# EasyEDA Pro project ESP32-NAT.epro

# Schematic Schematic1
Board Name: Board1; Create Date: 2025-11-01; Page Name: P1; Project Name: ESP32-NAT; Schematic Name: Schematic1; Update Date: 2025-12-23; Company: EasyEDA.com; Page Size: A4; Version: V1.0
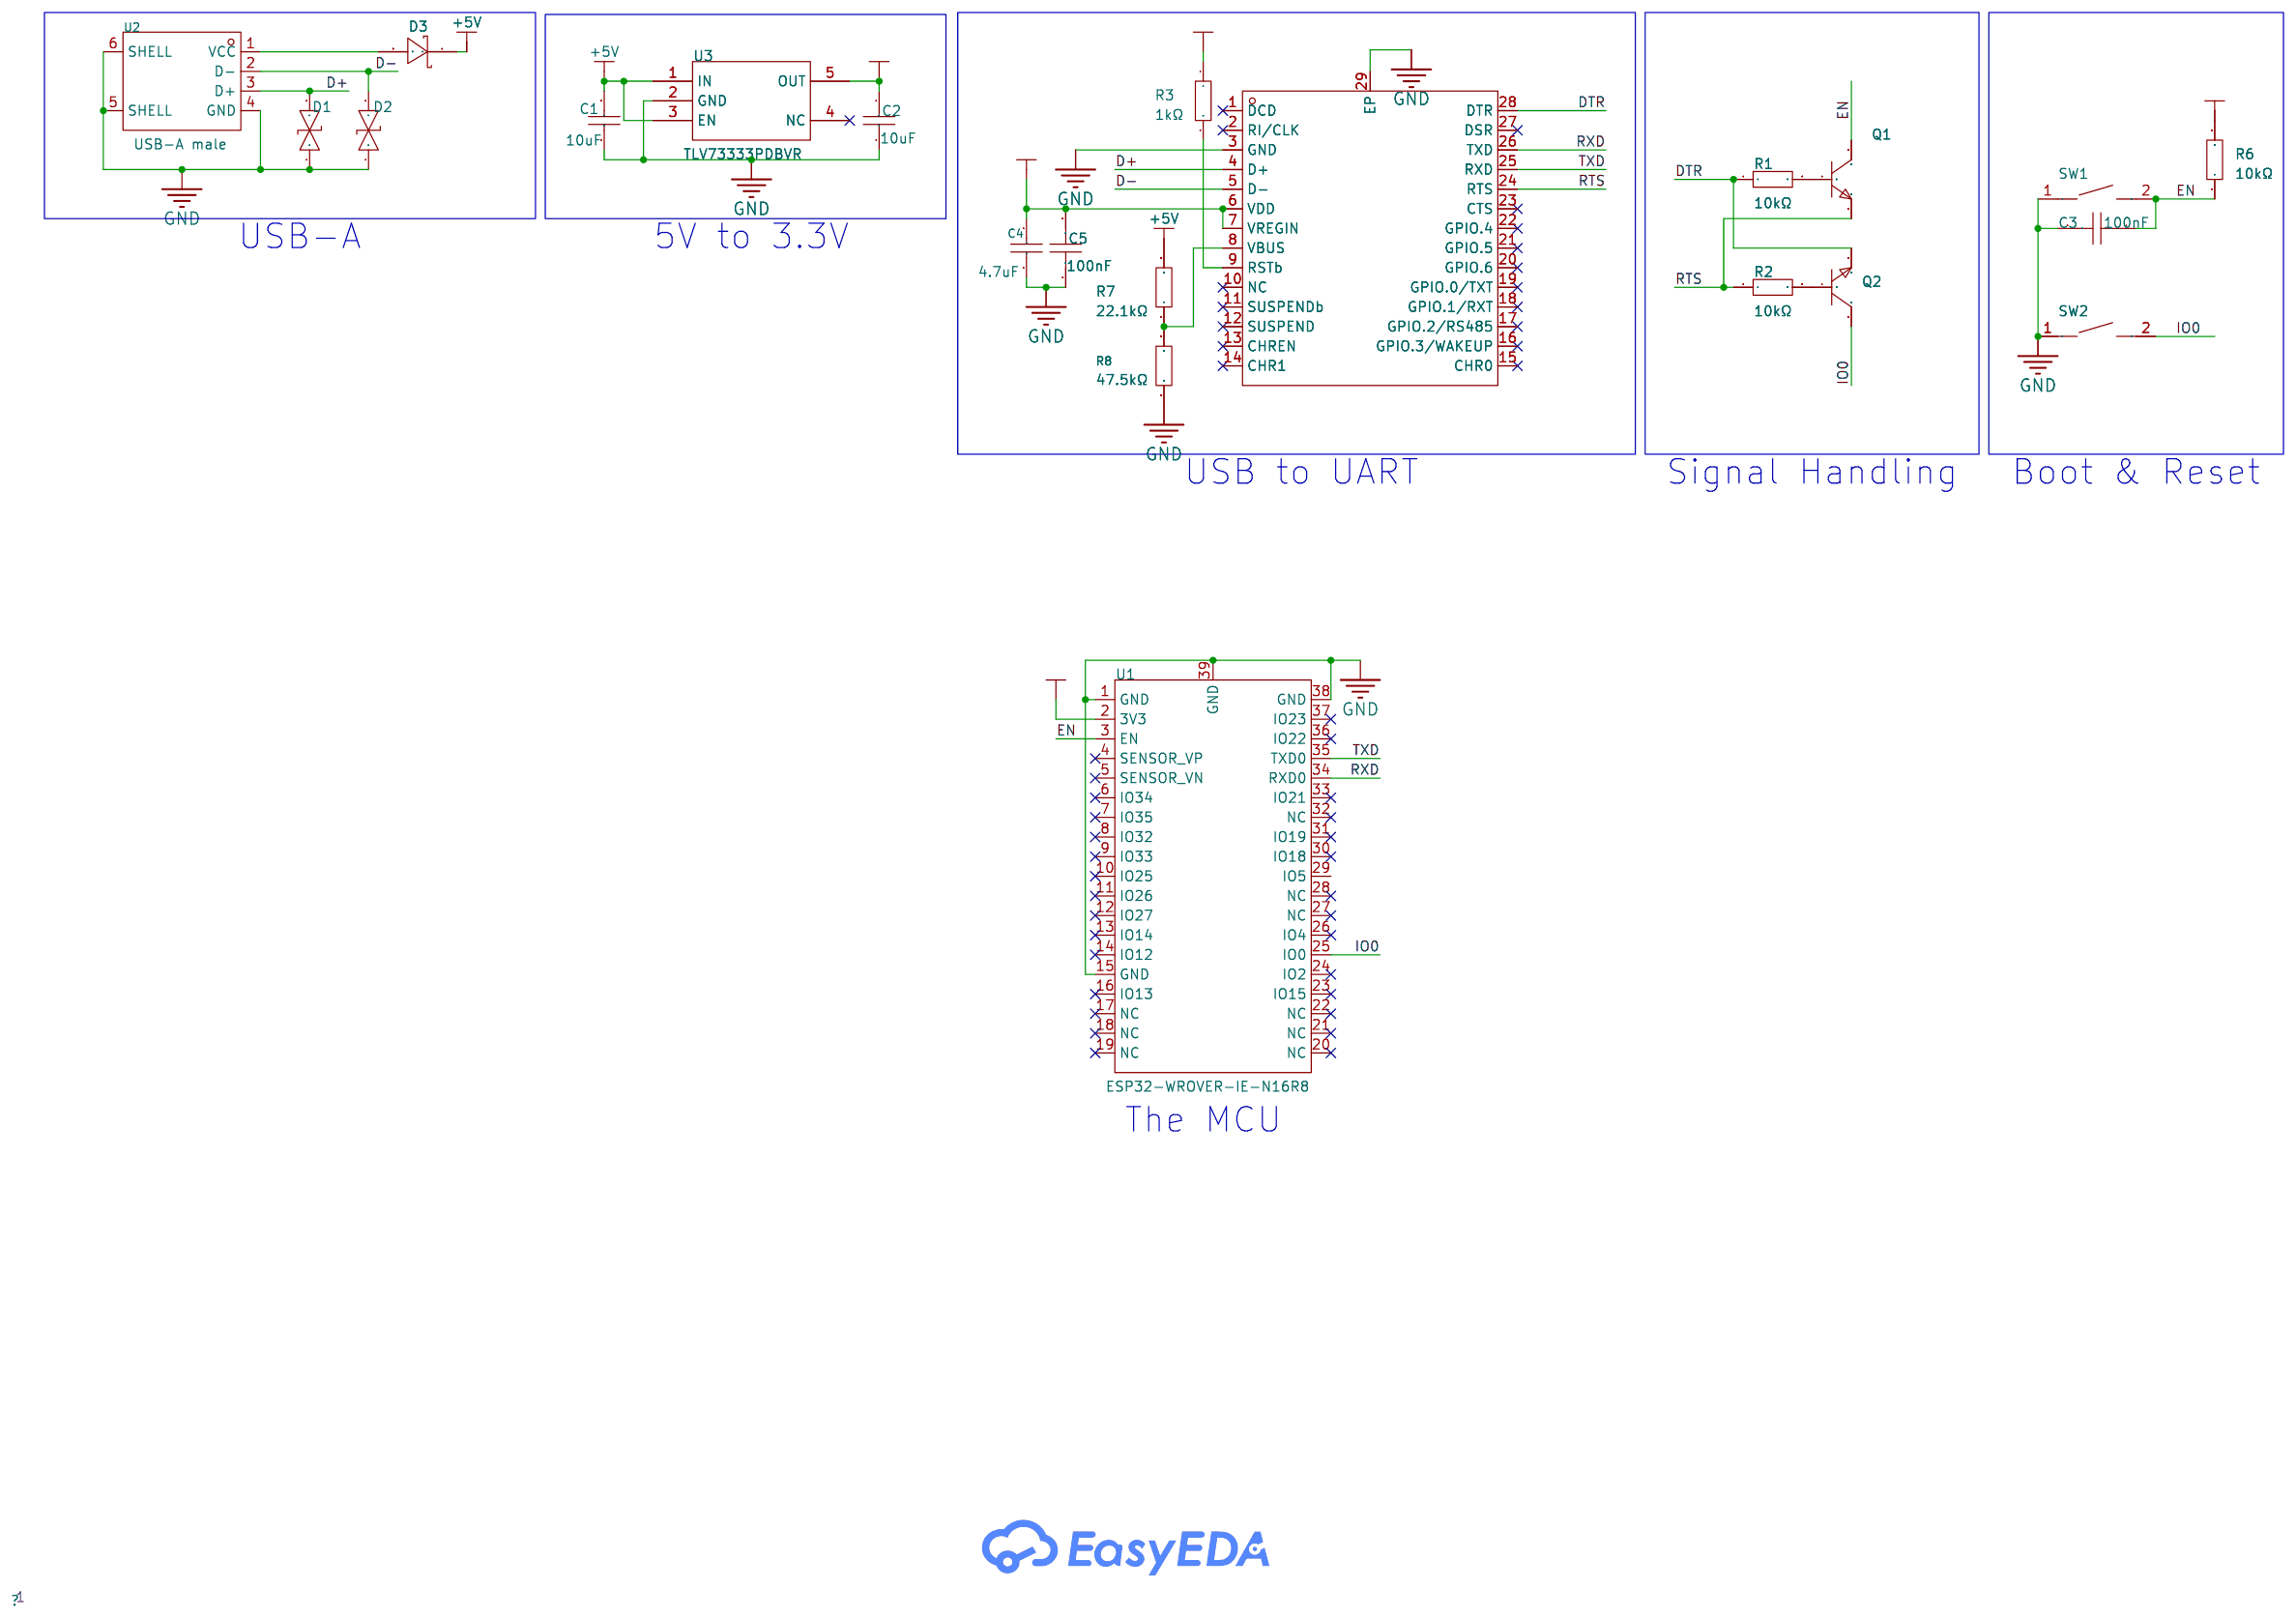
[diagram p0: schematic sheet]

## Parts
C1  10uF  [C0402_custom]
C2  10uF  [C0402_custom]
C3  100nF  [C0402_custom]
C4  4.7uF  [C0402_custom]
C5  100nF  [C0402_custom]
D1  LESD5D5.0CT1G-ES  [SOD-523_L1.2-W0.8-LS1.6-BI]
D2  LESD5D5.0CT1G-ES  [SOD-523_L1.2-W0.8-LS1.6-BI]
D3  BAT760-7  [SOD-323_L1.8-W1.3-LS2.5-RD]
Q1  SS8050-G  [SOT-23-3_L2.9-W1.5-P1.90-LS2.6-BR]
Q2  SS8050-G  [SOT-23-3_L2.9-W1.5-P1.90-LS2.6-BR]
R1  10kΩ  [R0402]
R2  10kΩ  [R0402]
R3  1kΩ  [R0402]
R6  10kΩ  [R0402]
R7  22.1kΩ  [R0402]
R8  47.5kΩ  [R0402]
SW1  TS-1088-AR02016  [SW-SMD_L3.9-W3.0-P4.45]
SW2  TS-1088-AR02016  [SW-SMD_L3.9-W3.0-P4.45]
U1  ESP32-WROVER-IE-N16R8  [WIFI-SMD_ESP32-WROVER-E-N8R2]
U2  USB-A male  [USB-SMD_USB-U203-BDS]
U3  TLV73333PDBVR  [SOT-23-5_L3.0-W1.7-P0.95-LS2.8-BR]
U4  CP2102N-A02-GQFN28R  [QFN-28_L5.0-W5.0-P0.50-TL-EP3.3]

## Library data of the parts
C1 C2 = CL05A106MQ5NUNC: Capacitance:10uF Tolerance:±20% Tolerance:±20% Voltage Rating:6.3V Temperature Coefficient:X5R; LCSC Part Name: 10uF ±20% 6.3V; Supplier Part: C15525; Manufacturer: SAMSUNG(三星); Supplier Footprint: 0402; Datasheet: https://item.szlcsc.com/datasheet/CL05A106MQ5NUNC/16204.html; Supplier: LCSC; Tolerance: ±20%; Voltage Rating: 6.3V; Temperature Coefficient: X5R
C3 C5 = CL05B104KO5NNNC: Capacitance:100nF Tolerance:±10% Tolerance:±10% Voltage Rating:16V Temperature Coefficient:X7R; LCSC Part Name: 100nF ±10% 16V; Supplier Part: C1525; Manufacturer: SAMSUNG(三星); Supplier Footprint: 0402; Datasheet: https://item.szlcsc.com/datasheet/CL05B104KO5NNNC/1877.html; Supplier: LCSC; Tolerance: ±10%; Voltage Rating: 16V; Temperature Coefficient: X7R
C4 = CL05A475MP5NRNC: Capacitance:4.7uF Tolerance:±20% Tolerance:±20% Voltage Rating:10V Temperature Coefficient:X5R; LCSC Part Name: 4.7uF ±20% 10V; Supplier Part: C23733; Manufacturer: SAMSUNG(三星); Supplier Footprint: 0402; Datasheet: https://item.szlcsc.com/datasheet/CL05A475MP5NRNC/24469.html; Supplier: LCSC; Tolerance: ±20%; Voltage Rating: 10V; Temperature Coefficient: X5R
D1 D2 = LESD5D5.0CT1G-ES: polarity:Bidirectional Reverse Stand-Off Voltage (Vrwm):5V Maximum Clamping Voltage:10V Peak Pulse Current (Ipp):8A Peak Pulse Power Dissipation (Ppp):80W Breakdown Voltage:5.8V Reverse Leakage Current (Ir):1uA Number of Lines:Single channel Operating Tem; LCSC Part Name: 普容5.0V，单路双向ESD静电防护器件，30kV，CJ：12pF；音频/视频/通讯防护; Supplier Part: C5199159; Manufacturer: ElecSuper(静芯微); Supplier Footprint: SOD523; Datasheet: https://atta.szlcsc.com/upload/public/pdf/source/20240905/10776531C4DE5F6ADA679023752259EC.pdf; Supplier: LCSC; polarity: Bidirectional; Reverse Stand-Off Voltage (Vrwm): 5V; Maximum Clamping Voltage: 10V; Peak Pulse Current (Ipp): 8A; Peak Pulse Power Dissipation (Ppp): 80W; Breakdown Voltage: 5.8V; Reverse Leakage Current (Ir): 1uA; Number of Lines: Single channel; Type: ESD
D3 = BAT760-7: Voltage - Forward(Vf@If):550mV@1A Voltage - DC Reverse(Vr):30V Current - Rectified:1A Reverse Leakage Current (Ir):50uA@15V Non-Repetitive Peak Forward Surge Current:5.5A; LCSC Part Name: 电压:30V 电流:1A; Supplier Part: C124187; Manufacturer: DIODES(美台); Supplier Footprint: SOD-323; Datasheet: https://item.szlcsc.com/datasheet/BAT760-7/125462.html; Supplier: LCSC; Voltage - Forward(Vf@If): 550mV@1A; Voltage - DC Reverse(Vr): 30V; Current - Rectified: 1A; Reverse Leakage Current (Ir): 50uA@15V; Non-Repetitive Peak Forward Surge Current: 5.5A
Q1 Q2 = SS8050-G: type:NPN Current - Collector(Ic):1.5A Collector - Emitter Voltage VCEO:25V Pd - Power Dissipation:300mW DC Current Gain:100@10mA,1V DC Current Gain:100@10mA,1V Transition frequency(fT):100MHz Current - Collector Cutoff:100nA Vce Saturation(VCE(sat)):400mV; LCSC Part Name: NPN 电流:1.5A 电压:25V; Supplier Part: C3199946; Manufacturer: Comchip(典琦); Supplier Footprint: SOT-23; Datasheet: https://item.szlcsc.com/datasheet/SS8050-G/3761708.html; Supplier: LCSC; type: NPN; Current - Collector(Ic): 1.5A; Collector - Emitter Voltage VCEO: 25V; Pd - Power Dissipation: 300mW; DC Current Gain: 100@10mA,1V; Transition frequency(fT): 100MHz; Current - Collector Cutoff: 100nA; Vce Saturation(VCE(sat)): 400mV@50mA,5mA
R1 R2 R6 = 0402WGF1002TCE: Type:Thick Film Resistor Resistance:10kΩ Tolerance:±1% Tolerance:±1% Power(Watts):62.5mW Voltage-Supply(Max):50V Temperature Coefficient:±100ppm/℃ Temperature Coefficient:±100ppm/℃ Operating Temperature:-55℃~+155℃ Operating Temperature:-55℃~+155℃; LCSC Part Name: 10kΩ ±1% 62.5mW 厚膜电阻; Supplier Part: C25744; Manufacturer: UNI-ROYAL(厚声); Supplier Footprint: 0402; JLCPCB Part Class: Basic Part; Datasheet: https://item.szlcsc.com/datasheet/0402WGF1002TCE/26487.html; Supplier: LCSC; Type: Thick Film Resistor; Tolerance: ±1%; Power(Watts): 62.5mW; Voltage-Supply(Max): 50V; Temperature Coefficient: ±100ppm/℃; Operating Temperature: -55℃~+155℃
R3 = 0402WGF1001TCE: Type:Thick Film Resistors Resistance:1kΩ Tolerance:±1% Tolerance:±1% Power(Watts): Overload Voltage (Max): Temperature Coefficient:±100ppm/℃ Temperature Coefficient:±100ppm/℃ Operating Temperature Range:-55℃~+155℃ Operating Temperature Range:-55℃~+155℃; LCSC Part Name: 1kΩ ±1% 62.5mW 厚膜电阻; Supplier Part: C11702; Manufacturer: UNI-ROYAL(厚声); Supplier Footprint: 0402; JLCPCB Part Class: Basic Part; Datasheet: https://atta.szlcsc.com/upload/public/pdf/source/20200306/C422600_1E6D84923E4A46A82E41ADD87F860B5C.pdf; Supplier: LCSC; Type: Thick Film Resistors; Tolerance: ±1%; Power(Watts): 62.5mW; Temperature Coefficient: ±100ppm/℃; Operating Temperature Range: -55℃~+155℃; Voltage-Supply(Max): 50V; Operating Temperature: -55℃~+155℃
R7 = 0402WGF2212TCE: Type:Thick Film Resistor Resistance:22.1kΩ Tolerance:±1% Tolerance:±1% Power(Watts):62.5mW Voltage-Supply(Max):50V Temperature Coefficient:±100ppm/℃ Temperature Coefficient:±100ppm/℃ Operating Temperature:-55℃~+155℃ Operating Temperature:-55℃~+155℃; LCSC Part Name: 22.1kΩ ±1% 62.5mW 厚膜电阻; Supplier Part: C43473; Manufacturer: UNI-ROYAL(厚声); Supplier Footprint: 0402; Datasheet: https://item.szlcsc.com/datasheet/0402WGF2212TCE/44464.html; Supplier: LCSC; Type: Thick Film Resistor; Tolerance: ±1%; Power(Watts): 62.5mW; Voltage-Supply(Max): 50V; Temperature Coefficient: ±100ppm/℃; Operating Temperature: -55℃~+155℃
R8 = 0402WGF4752TCE: Type:Thick Film Resistor Resistance:47.5kΩ Tolerance:±1% Tolerance:±1% Power(Watts):62.5mW Voltage-Supply(Max):50V Temperature Coefficient:±100ppm/℃ Temperature Coefficient:±100ppm/℃ Operating Temperature:-55℃~+155℃ Operating Temperature:-55℃~+155℃; LCSC Part Name: 47.5kΩ ±1% 62.5mW 厚膜电阻; Supplier Part: C25896; Manufacturer: UNI-ROYAL(厚声); Supplier Footprint: 0402; Datasheet: https://item.szlcsc.com/datasheet/0402WGF4752TCE/26639.html; Supplier: LCSC; Type: Thick Film Resistor; Tolerance: ±1%; Power(Watts): 62.5mW; Voltage-Supply(Max): 50V; Temperature Coefficient: ±100ppm/℃; Operating Temperature: -55℃~+155℃
SW1 SW2 = TS-1088-AR02016: Circuit:SPST Actuator Style:Round Button Operating Force:160gf Mounting Style:Brick nogging Switch Length:4mm Switch Width:3mm Switch Height:2mm Strike Gundam:不带 Contact Current:50mA Voltage Rating (DC):12V Insulation Resistance:100MΩ Actuator/Cap Color:B; LCSC Part Name: 4*3*2mm 立贴 轻触开关; Supplier Part: C720477; Manufacturer: XUNPU(讯普); Supplier Footprint: SMD; JLCPCB Part Class: Basic Part; Datasheet: https://atta.szlcsc.com/upload/public/pdf/source/20200810/C720475_60D09DD6C54279ADDB2DC25100F1CC11.pdf; Supplier: LCSC; Circuit: SPST; Actuator Style: Round Button; Operating Force: 160gf; Mounting Style: Brick nogging; Switch Length: 4mm; Switch Width: 3mm; Switch Height: 2mm; Strike Gundam: 不带; Contact Current: 50mA; Voltage Rating (DC): 12V; Insulation Resistance: 100MΩ; Actuator/Cap Color: Black; Pin Style: SMDSplicing; Mechanical Life: 10万次; Operating Temperature: -30℃~+80℃; Mounting Type: Surface Mount,Vertical; Length: 4mm; Width: 3mm; with Bracket: Without Bracket; Voltage Rating: 12V; Termination Style: SMD(SMT) Tab; Life: 100,000 Cycles
U1 = ESP32-WROVER-IE-N16R8: LCSC Part Name: 通用型Wi-Fi+BT+BLE MCU模组; Supplier Part: C701352; Manufacturer: ESPRESSIF(乐鑫); Supplier Footprint: SMD,18x31.4mm; JLCPCB Part Class: Extended Part; Datasheet: https://atta.szlcsc.com/upload/public/pdf/source/20200730/C701352_037A60005F1BF393F126A44EB320B018.pdf; Supplier: LCSC
U2 = USB-U203-BDS: Connector Type:Type-A Protocol Standard:USB 2.0 Gender:Male Mounting Type:Surface Mount, Right Angle Number of Contacts:4P Number of Ports:1 Current Rating-Power:1.5A Voltage Rating:30V Connect-Disconnect Life:1500 Cycles Operating Temperature:0℃~+50℃ Ope; LCSC Part Name: Type-A 公 卧贴; Supplier Part: C2962378; Manufacturer: HANBO(汉博); Supplier Footprint: SMD; JLCPCB Part Class: Extended Part; Datasheet: https://item.szlcsc.com/datasheet/USB-U203-BDS/3352870.html; Supplier: LCSC; Connector Type: Type-A; Protocol Standard: USB 2.0; Gender: Male; Mounting Type: Surface Mount, Right Angle; Number of Contacts: 4P; Number of Ports: 1; Current Rating-Power: 1.5A; Voltage Rating: 30V; Connect-Disconnect Life: 1500 Cycles; Operating Temperature: 0℃~+50℃
U3 = TLV73333PDBVR: Output Type:Fixed Voltage - Supply:5.5V Output Voltage:3.3V Output Voltage:3.3V Output Current:300mA Power Supply Rejection Ratio (PSRR):50dB@(1kHz) Voltage Dropout:125mV@(300mA) standby current:34uA Noise:28uVrms Features:Under Voltage Lockout；Over Curre; LCSC Part Name: 具有使能功能的 300mA、低 IQ、低压降无电容稳压器; Supplier Part: C134139; Manufacturer: TI(德州仪器); Supplier Footprint: SOT-23-5; JLCPCB Part Class: Extended Part; Datasheet: https://www.ti.com/cn/lit/gpn/tlv733p; Supplier: LCSC; Output Type: Fixed; Voltage - Supply: 5.5V; Output Voltage: 3.3V; Output Current: 300mA; Power Supply Rejection Ratio (PSRR): 50dB@(1kHz); Voltage Dropout: 125mV@(300mA); standby current: 34uA; Noise: 28uVrms; Features: Under Voltage Lockout；Over Current Protection；Enable；Over Temperature Protection; Operating Temperature: -40℃~+125℃@(Tj); Output Configuration: Positive; Number of Outputs: 1
U4 = CP2102N-A02-GQFN28R: Applications Function:USB to UART USB Protocol:USB 2.0 Voltage - Supply:3V~3.6V Voltage - Supply:3V~3.6V Operating Temperature:-40℃~+85℃@(Ta) Operating Temperature:-40℃~+85℃@(Ta) Current - Supply:9.5mA Supply Current (Iq):1.3uA; Supplier Part: C964632; Manufacturer: SKYWORKS/SILICON LABS(芯科); Supplier Footprint: QFN-28-EP(5x5); JLCPCB Part Class: Extended Part; Datasheet: https://item.szlcsc.com/datasheet/CP2102N-A02-GQFN28R/1049893.html; Supplier: LCSC; Applications Function: USB to UART; USB Protocol: USB 2.0; Voltage - Supply: 3V~3.6V; Operating Temperature: -40℃~+85℃@(Ta); Current - Supply: 9.5mA; Supply Current (Iq): 1.3uA

## Nets
+3V3: C2.2 C4.2 C5.2 R3.1 R6.2 U1.2(3V3) U3.5(OUT) U4.6(VDD) U4.7(VREGIN)
+5V: C1.2 D3.1 R7.2 U3.1(IN) U3.3(EN)
GND: C1.1 C2.1 C3.2 C4.1 C5.1 D1.1 D2.1 R8.1 SW1.1 SW2.1 U1.1(GND) U1.15(GND) U1.38(GND) U1.39(GND) U2.4(GND) U2.5(SHELL) U2.6(SHELL) U3.2(GND) U4.3(GND) U4.29(EP)
D+: D1.2 U2.3(D+) U4.4(D+)
D-: D2.2 U2.2(D-) U4.5(D-)
DTR: Q2.2(E) R1.1 U4.28(DTR)
EN: C3.1 Q1.3(C) R6.1 SW1.2 U1.3(EN)
IO0: Q2.3(C) SW2.2 U1.25(IO0)
RTS: Q1.2(E) R2.1 U4.24(RTS)
RXD: U1.34(RXD0) U4.26(TXD)
TXD: U1.35(TXD0) U4.25(RXD)
$1N11244: D3.2 U2.1(VCC)
$1N12278: Q1.1(B) R1.2
$1N12283: Q2.1(B) R2.2
$1N13367: R3.2 U4.9(RSTb)
$1N15037: R7.1 R8.2 U4.8(VBUS)

Not connected (* = marked no-connect by the designer): U1 4(SENSOR_VP)* 5(SENSOR_VN)* 6(IO34)* 7(IO35)* 8(IO32)* 9(IO33)* 10(IO25)* 11(IO26)* 12(IO27)* 13(IO14)* 14(IO12)* 16(IO13)* 17(NC)* 18(NC)* 19(NC)* 20(NC)* 21(NC)* 22(NC)* 23(IO15)* 24(IO2)* 26(IO4)* 27(NC)* 28(NC)* 29(IO5) 30(IO18)* 31(IO19)* 32(NC)* 33(IO21)* 36(IO22)* 37(IO23)*; U3 4(NC)*; U4 1(DCD)* 2(RI/CLK)* 10(NC)* 11(SUSPENDb)* 12(SUSPEND)* 13(CHREN)* 14(CHR1)* 15(CHR0)* 16(GPIO.3/WAKEUP)* 17(GPIO.2/RS485)* 18(GPIO.1/RXT)* 19(GPIO.0/TXT)* 20(GPIO.6)* 21(GPIO.5)* 22(GPIO.4)* 23(CTS)* 27(DSR)*

## Notes on the sheet
- USB-A
- 5V to 3.3V
- USB to UART
- Signal Handling
- Boot & Reset
- The MCU

# Board PCB1
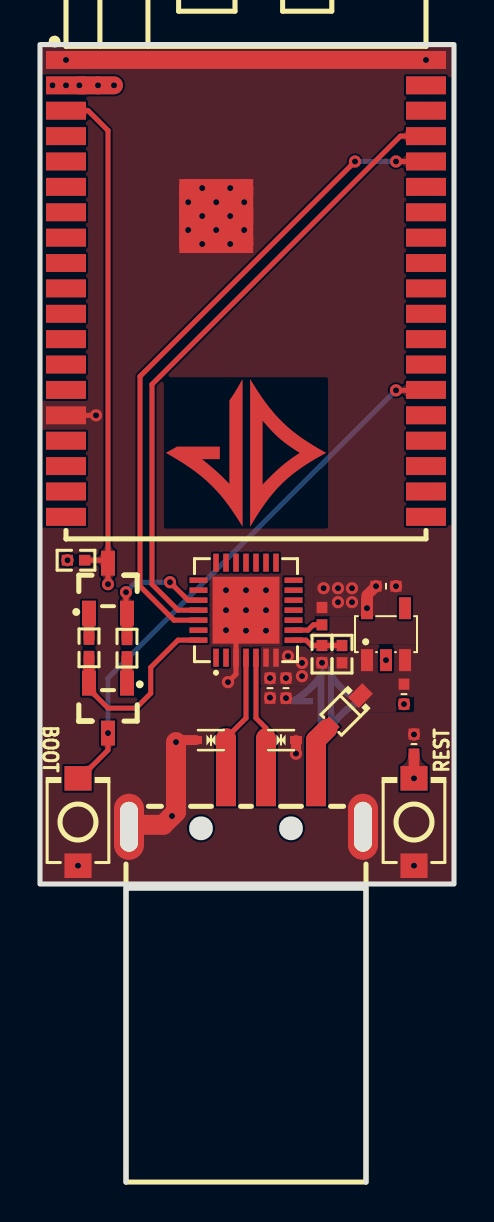
[diagram p1: board, top side]
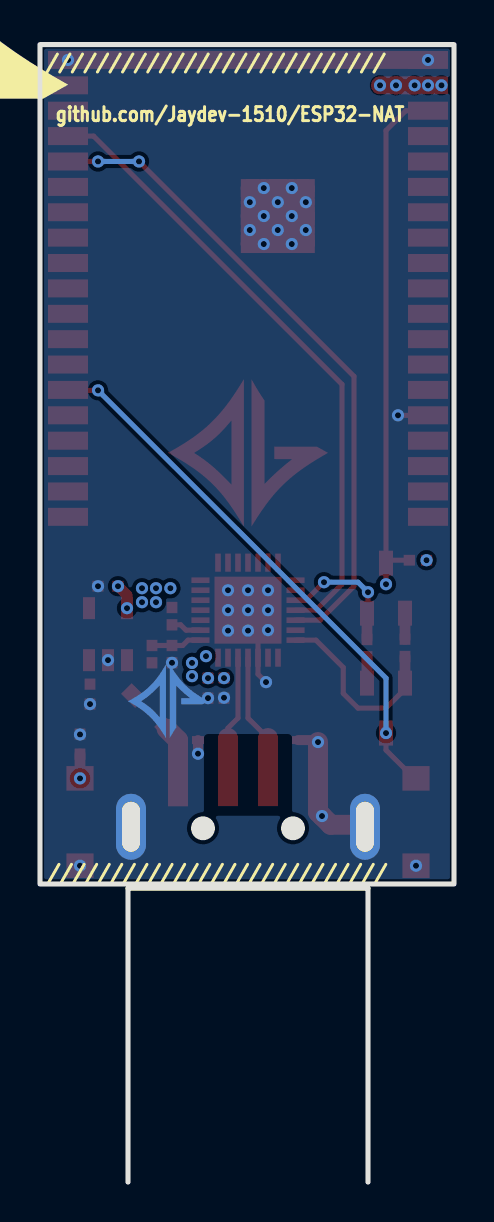
[diagram p2: board, bottom side, seen from below]

Outline 20.7 x 56.91 mm; copper layers: Top Layer, Inner1, Inner2, Bottom Layer. Coordinates in mm from the lower left corner of the outline.
Outline path: rectangle 0,56.91 20.7,14.91
Stack: Top Layer 0.035mm Outer layer thickness 1oz / Dielectric1 0.2104mm 7628 RC49% 8.6mil / Inner1 0.0152mm Inner layer thickness / Dielectric2 1.065mm 1.1mm H/HOZ Copper / Inner2 0.0152mm Inner layer thickness / Dielectric3 0.2104mm 7628 RC49% 8.6mil / Bottom Layer 0.035mm Outer layer thickness 1oz

## Design rules (mm)
template: Custom Config
spacing copperThickness1oz (default): track to track 0.102, other pairs 0.152 to 0.3
spacing copperThickness2oz: track to track 0.203, other pairs 0.152 to 0.3
track width copperThickness1oz (default): min 0.127, default 0.254, max 2.54
track width copperThickness2oz: min 0.203, default 0.254, max 2.54
differential pair differentialPair (default): width min 0.127, default 0.254, max 2.54; gap min 0.152, default 0.152
via viaSize (default): diameter min 0.5, default 0.61, max 10; hole min 0.3, default 0.305, max 6.3

## Placement (name value [footprint] x y rotation side)
C1  10uF  [C0402_custom]  18.2 24.41 90 top
C2  10uF  [C0402_custom]  17.3 29.81 180 top
C3  100nF  [C0402_custom]  18.7 21.91 90 top
C4  4.7uF  [C0402_custom]  12.3 24.71 90 top
C5  100nF  [C0402_custom]  11.5 24.71 90 top
D1  LESD5D5.0CT1G-ES  [SOD-523_L1.2-W0.8-LS1.6-BI]  8.55 22.11 0 top
D2  LESD5D5.0CT1G-ES  [SOD-523_L1.2-W0.8-LS1.6-BI]  12.05 22.11 180 top
D3  BAT760-7  [SOD-323_L1.8-W1.3-LS2.5-RD]  15.2 23.51 225 top
Q1  SS8050-G  [SOT-23-3_L2.9-W1.5-P1.90-LS2.6-BR]  3.4 29.71 270 top
Q2  SS8050-G  [SOT-23-3_L2.9-W1.5-P1.90-LS2.6-BR]  3.4 23.71 90 top
R1  10kΩ  [R0402]  2.45 26.73 90 top
R2  10kΩ  [R0402]  4.35 26.71 270 top
R3  1kΩ  [R0402]  14.1 28.31 270 top
R6  10kΩ  [R0402]  1.8 31.11 180 top
R7  22.1kΩ  [R0402]  15.1 26.41 270 top
R8  47.5kΩ  [R0402]  14.1 26.41 90 top
SW1  TS-1088-AR02016  [SW-SMD_L3.9-W3.0-P4.45]  18.7 18.01 90 top
SW2  TS-1088-AR02016  [SW-SMD_L3.9-W3.0-P4.45]  1.9 18.01 90 top
U1  ESP32-WROVER-IE-N16R8  [WIFI-SMD_ESP32-WROVER-E-N8R2]  10.3 44.71 0 top
U2  USB-A male  [USB-SMD_USB-U203-BDS]  10.3 18.91 0 top
U3  TLV73333PDBVR  [SOT-23-5_L3.0-W1.7-P0.95-LS2.8-BR]  17.3 27.41 270 top
U4  CP2102N-A02-GQFN28R  [QFN-28_L5.0-W5.0-P0.50-TL-EP3.3]  10.3 28.61 90 top

## Footprints (pads in the part's own frame, mm; a bottom-side part is the same pattern mirrored in y, then rotated)
C0402_custom
  rect 0.56x0.54 smd: 1(-0.5,0) 2(0.5,0)
QFN-28_L5.0-W5.0-P0.50-TL-EP3.3
  rect 0.905x0.28 smd: 1(-2.377,1.5) 2(-2.377,1) 3(-2.377,0.5) 4(-2.377,0) 5(-2.377,-0.5) 6(-2.377,-1) 7(-2.377,-1.5) 15(2.377,-1.5) 16(2.377,-1) 17(2.377,-0.5) 18(2.377,0) 19(2.377,0.5) 20(2.377,1) 21(2.377,1.5)
  rect 0.28x0.905 smd: 8(-1.5,-2.377) 9(-1,-2.377) 10(-0.5,-2.377) 11(0,-2.377) 12(0.5,-2.377) 13(1,-2.377) 14(1.5,-2.377) 22(1.5,2.377) 23(1,2.377) 24(0.5,2.377) 25(0,2.377) 26(-0.5,2.377) 27(-1,2.377) 28(-1.5,2.377)
  rect 3.35x3.35 smd: 29(0,0)
R0402
  rect 0.566x0.54 smd: 1(-0.433,0) 2(0.433,0)
SOD-323_L1.8-W1.3-LS2.5-RD
  rect 1x0.75 smd: 1(-1.173,0) 2(1.173,0)
SOD-523_L1.2-W0.8-LS1.6-BI
  rect 0.6x0.4 smd: 1(-0.75,0) 2(0.75,0)
SOT-23-3_L2.9-W1.5-P1.90-LS2.6-BR
  rect 1.25x0.7 smd: 1(1.25,-0.95) 2(1.25,0.95) 3(-1.25,0)
SOT-23-5_L3.0-W1.7-P0.95-LS2.8-BR
  rect 1.1x0.6 smd: 1(1.3,-0.95) 2(1.3,0) 3(1.3,0.95) 4(-1.3,0.95) 5(-1.3,-0.95)
SW-SMD_L3.9-W3.0-P4.45
  rect 1.23x1.36 smd: 1(-2.185,0) 2(2.185,0)
USB-SMD_USB-U203-BDS
  rect 1x2.5 smd: 1(3.5,1.137) 2(1,1.137) 3(-1,1.137) 4(-3.5,1.137)
  oval 1.5x3.3 hole 0.9x2.5: 5(-5.85,-1.137) 6(5.85,-1.137)
WIFI-SMD_ESP32-WROVER-E-N8R2
  rect 2x0.9 smd: 1(-9,11.43) 2(-9,10.16) 3(-9,8.89) 4(-9,7.62) 5(-9,6.35) 6(-9,5.08) 7(-9,3.81) 8(-9,2.54) 9(-9,1.27) 10(-9,0) 11(-9,-1.27) 12(-9,-2.54) 13(-9,-3.81) 14(-9,-5.08) 15(-9,-6.35) 16(-9,-7.62) 17(-9,-8.89) 18(-9,-10.16) 19(-9,-11.43) 20(9,-11.43) 21(9,-10.16) 22(9,-8.89) 23(9,-7.62) 24(9,-6.35) 25(9,-5.08) 26(9,-3.81) 27(9,-2.54) 28(9,-1.27) 29(9,0) 30(9,1.27) 31(9,2.54) 32(9,3.81) 33(9,5.08) 34(9,6.35) 35(9,7.62) 36(9,8.89) 37(9,10.16) 38(9,11.43)
  rect 0.9x0.9 smd: 39(-2.89,5.02) 39(-2.89,3.62) 39(-2.89,2.22) 39(-1.49,5.02) 39(-1.49,3.62) 39(-1.49,2.22) 39(-0.09,5.02) 39(-0.09,3.62) 39(-0.09,2.22)

## Nets
As in the schematic.

Pads without a net: U1 4 5 6 7 8 9 10 11 12 13 14 16 17 18 19 20 21 22 23 24 26 27 28 29 30 31 32 33 36 37; U3 4; U4 1 2 10 11 12 13 14 15 16 17 18 19 20 21 22 23 27

## Via types
v1: diameter 0.61, hole 0.305, Top Layer to Bottom Layer, 63 vias

## Routing (per net, layer and track width the routed paths; a pad name or vN(x,y) marks a point on that pad's centre or on a via; arc(x,y) is an arc through that point)
+3V3: length 3.7
  Top Layer w0.254: v1(1.3,54.87) v1(1.97,54.87)
  Top Layer w0.54: v1(16.8,29.81) 16.35,29.36 v1(16.35,28.71)
  Top Layer w0.9: v1(1.97,54.87) v1(2.9,54.87) v1(3.7,54.87)
  vias: v1(0.63,54.87) v1(1.37,31.11) v1(11.5,25.21) v1(12.3,25.21) v1(12.4,26.31) v1(13.1,25.97) v1(13.1,25.31) v1(14.18,29.71) v1(14.9,29.71) v1(14.9,29.01) v1(15.6,29.71) v1(15.6,29.01)
GND: length 56
  Top Layer w0.254: U1.15 v1(2.8,38.36) ; v1(9.4,25.01) 9.8,25.41 U4.3 9.8,28.11 v1(10.3,28.61)
  Top Layer w0.5: D2.1 v1(12.8,21.43) ; D1.1 6.9,22.11 v1(6.8,22.01)
  Top Layer w0.9: U1.39 v1(10.21,49.03) U1.39 ; U1.39 v1(10.21,47.63) U1.39 ; U1.39 v1(9.51,48.33) U1.39 ; U1.39 U1.39 ; U1.39 v1(9.51,49.73) U1.39 ; U1.39 v1(9.51,46.93) U1.39 ; U1.39 U1.39 ; U1.39 v1(7.41,49.03) U1.39 ; U1.39 v1(8.11,48.33) U1.39 ; U1.39 v1(7.41,47.63) U1.39 ; U1.39 v1(8.81,47.63) U1.39 ; U1.39 v1(8.81,49.03) U1.39 ; U1.39 U1.39 ; U1.39 U1.39 ; U1.39 v1(8.11,46.93) U1.39 ; U1.39 v1(8.11,49.73) U1.39 ; v1(19.3,56.14) v1(1.3,56.14)
  Top Layer w1: 4.45,17.88 6.16,17.88 v1(6.6,18.31) 6.8,18.51 U2.4 v1(6.8,22.01)
  vias: v1(1.9,15.83) v1(9.3,29.61) v1(9.3,28.61) v1(9.3,27.61) v1(10.3,29.61) v1(10.3,27.59) v1(11.3,29.61) v1(11.3,28.61) v1(11.3,27.59) v1(11.5,24.23) v1(12.3,24.21) v1(14.1,25.98) v1(17.3,26.11) v1(17.8,29.81) v1(18.2,23.91) v1(18.7,22.39) v1(18.7,15.83)
D+: length 6.5
  Top Layer w0.254: 9.3,22.21 10.3,23.21 U4.4
  Top Layer w1: 9.3,22.21 9.3,20.15
D-: length 6.3
  Top Layer w0.254: 11.3,22.21 11.3,22.71 10.8,23.21 U4.5
  Top Layer w1: 11.3,20.15 11.3,22.21
DTR: length 9.7
  Top Layer w0.254: U4.28 6.9,27.11 5.54,25.75 5.54,24.45 4.8,23.71 3.4,23.71 2.45,24.66 Q2.2
  Top Layer w0.54: R1.1 Q2.2
EN: length 47.6
  Top Layer w0.254: Q1.3 3.25,31.11 R6.1 ; Q1.3 v1(3.4,29.91) ; Q1.3 3.4,52.61 2.41,53.6 U1.3
  Top Layer w0.54: C3.1 v1(18.7,20.2)
  Inner1 w0.254: v1(3.4,29.91) 3.4,28.81 9,23.21 15.69,23.21 v1(18.7,20.2)
IO0: length 27.6
  Top Layer w0.254: 1.9,20.2 1.98,20.2 3.4,21.61 v1(3.4,22.46) ; U1.25 19.28,39.61 v1(17.8,39.61)
  Bottom Layer w0.254: v1(3.4,22.46) 3.4,25.21 v1(17.8,39.61)
RTS: length 6.6
  Top Layer w0.254: U4.24 7.4,29.11 v1(6.5,30.01) ; v1(4.3,29.51) 4.3,28.51 Q1.2
  Top Layer w0.54: Q1.2 R2.1
  Bottom Layer w0.254: v1(6.5,30.01) 4.8,30.01 v1(4.3,29.51)
RXD: length 32.9
  Top Layer w0.254: v1(17.8,51.06) U1.34 ; v1(15.75,51.06) 5,40.31 5,29.81 6.7,28.11 U4.26
  Bottom Layer w0.254: v1(15.75,51.06) v1(17.8,51.06)
TXD: length 31.7
  Top Layer w0.254: U4.25 6.9,28.61 5.6,29.91 5.6,39.91 18.02,52.33 U1.35
$1N11244: length 2.9
  Top Layer w1: 14.37,22.68 13.8,22.11 U2.1
$1N12278: length 1.3
  Top Layer w0.54: Q1.1 R1.2
$1N12283: length 1.3
  Top Layer w0.543: 4.35,26.28 Q2.1
$1N13367: length 1.5
  Top Layer w0.254: U4.9 13.4,27.61 13.67,27.88 R3.2
$1N15037: length 2.5
  Top Layer w0.254: R7.1 R8.2 13.57,26.84 13.3,27.11 U4.8

## Copper pours and planes (outline as drawn; the poured copper is in the pictures)
+3V3 on Top Layer: 13.8,30.21 17.3,30.21 17.3,28.41 13.8,28.41
+3V3 on Top Layer: 11.1,26.71 13.5,26.71 13.5,24.91 11.1,24.91
+3V3 on Inner1: 0,56.91 20.7,56.91 20.7,14.91 0,14.91
+5V on Top Layer: 14.83,26.81 18.6,26.81 18.6,23.61 14.83,23.61
GND on Top Layer: 0,56.91 20.7,56.91 20.7,14.91 0,14.91
GND on Bottom Layer: -0.2,56.91 20.6,56.91 20.6,15.15 -0.2,15.15
GND on Inner2: 0.26,56.66 20.44,56.66 20.44,15.17 0.26,15.17

Small or netless copper shapes (teardrops, artwork), in the pictures only: 65 on Top Layer, 8 on Bottom Layer, 2 on Inner1, 8 on Inner2

## Text on the board
Bottom Silkscreen Layer: github.com/Jaydev-1510/ESP32-NAT | ///////////////////////////
Top Silkscreen Layer: REST | BOOT
